# Altium schematic sheet cpuPowerAndJtag.SchDoc
size A
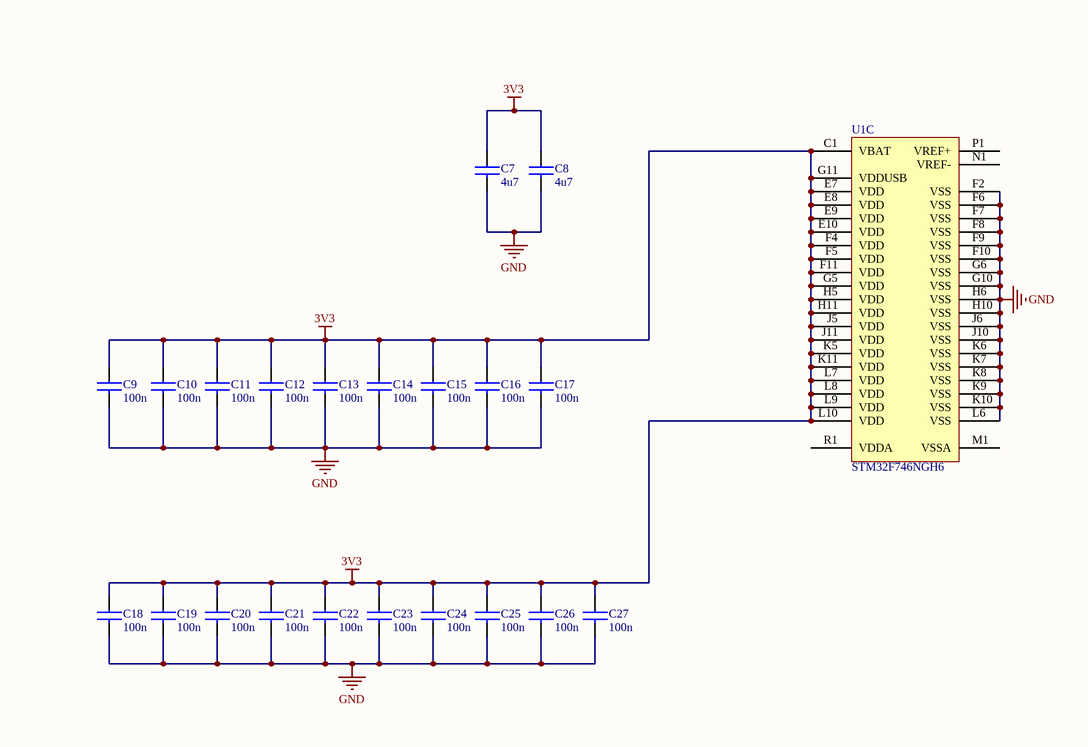
[diagram p0: cpuPowerAndJtag.SchDoc, bottom right]

## Parts
C7  4u7  [C0402]
C8  4u7  [C0402]
C9  100n  [C0402]
C10  100n  [C0402]
C11  100n  [C0402]
C12  100n  [C0402]
C13  100n  [C0402]
C14  100n  [C0402]
C15  100n  [C0402]
C16  100n  [C0402]
C17  100n  [C0402]
C18  100n  [C0402]
C19  100n  [C0402]
C20  100n  [C0402]
C21  100n  [C0402]
C22  100n  [C0402]
C23  100n  [C0402]
C24  100n  [C0402]
C25  100n  [C0402]
C26  100n  [C0402]
C27  100n  [C0402]
U1  STM32F746NGH6  [STM-TFBGA216]  (part C of 3)

## Nets
3V3: C7.1 C8.1 C9.1 C10.1 C11.1 C12.1 C13.1 C14.1 C15.1 C16.1 C17.1 C18.1 C19.1 C20.1 C21.1 C22.1 C23.1 C24.1 C25.1 C26.1 C27.1 U1.C1(VBAT) U1.E7(VDD) U1.E8(VDD) U1.E9(VDD) U1.E10(VDD) U1.F4(VDD) U1.F5(VDD) U1.F11(VDD) U1.G5(VDD) U1.G11(VDDUSB) U1.H5(VDD) U1.H11(VDD) U1.J5(VDD) U1.J11(VDD) U1.K5(VDD) U1.K11(VDD) U1.L7(VDD) U1.L8(VDD) U1.L9(VDD) U1.L10(VDD)
GND: C7.2 C8.2 C9.2 C10.2 C11.2 C12.2 C13.2 C14.2 C15.2 C16.2 C17.2 C18.2 C19.2 C20.2 C21.2 C22.2 C23.2 C24.2 C25.2 C26.2 C27.2 U1.F2(VSS) U1.F6(VSS) U1.F7(VSS) U1.F8(VSS) U1.F9(VSS) U1.F10(VSS) U1.G6(VSS) U1.G10(VSS) U1.H6(VSS) U1.H10(VSS) U1.J6(VSS) U1.J10(VSS) U1.K6(VSS) U1.K7(VSS) U1.K8(VSS) U1.K9(VSS) U1.K10(VSS) U1.L6(VSS)

Not connected (* = marked no-connect by the designer): U1 M1(VSSA) N1(VREF-) P1(VREF+) R1(VDDA)

## Library data of the parts
C7 C8 = C1005X5R1A475M: CAP CER 4.7UF 10V 20% X5R 0402; Manufacturer: TDK Corporation; Capacitance: 4.7µF; .Checked PCB: RF; Supplier 1: Digi-Key; Supplier Part Number 1: 445-8023-1-ND; Manufacturer Part Number: C1005X5R1A475M; RoHS: RoHS Compliant; Category: Capacitors; Stock 1: 10140; Pricing 1: 1=0.53, 10=0.415, 100=0.25, 250=0.18752, 500=0.16, 1000=0.125, 5000=0.095 (USD); Voltage - Rated: 10V; Tolerance: ±20%; Temperature Coefficient: X5R; Mounting Type: Surface Mount, MLCC; Operating Temperature: -55°C ~ 85°C; Applications: General Purpose; Ratings: -; Package / Case: 0402 (1005 Metric); Size / Dimension: 0.039" L x 0.020" W (1.00mm x 0.50mm); Height - Seated (Max): -; Thickness (Max): -; Lead Spacing: -; Features: -; Packaging: Cut Tape (CT); Lead Style: -; ComponentLink1URL: http://www.tdk.com/pdf/general_B11.pdf; ComponentLink1Description: http://www.tdk.com/pdf/general_B11.pdf; .Checked SCH: RF
C9-C27 = C1005X5R1H104K: CAP CER .10UF 50V X5R 10% 0402; Manufacturer: TDK Corporation; Capacitance: 0.1µF; Value: 100nF; .Checked PCB: used; Category: Capacitors; Supplier Part Number: 445-5942-1-ND; Manufacturer Part Number: C1005X5R1H104K; Operating Temperature: -55°C ~ 85°C; Package / Case: 0402 (1005 Metric); Price 1k [$]: 0.02340; .Checked SCH: used; Voltage - Rated: 50V; Supplier: Digikey; Supplier 1: Digi-Key; Supplier Part Number 1: 445-5942-1-ND; RoHS: RoHS Compliant; Stock 1: 106926; Pricing 1: 1=0.27, 10=0.18, 100=0.072, 250=0.05176, 500=0.0369, 1000=0.027 (USD); Tolerance: ±10%; Temperature Coefficient: X5R; Mounting Type: Surface Mount, MLCC; Applications: General Purpose; Ratings: -; Size / Dimension: 0.039" L x 0.020" W (1.00mm x 0.50mm); Height - Seated (Max): -; Thickness (Max): 0.022" (0.55mm); Lead Spacing: -; Features: -; Packaging: Cut Tape (CT); Lead Style: -; ComponentLink1URL: http://www.tdk.co.jp/tefe02/e412_c.pdf; ComponentLink1Description: http://www.tdk.co.jp/tefe02/e412_c.pdf
U1 = STM32F746NGH6: ARM-Based Cortex-M7 32 Bit MCU+FPU, 462 DMIPS, 1024 kB Flash, 320 kB RAM, 168 I/Os, -40 to 85 degC, 216-Pin TFBGA, Halogen-Free, Tray; L1 Cache Data Memory: 4 KByte; Program Memory Size: 1024 KByte; Supply Voltage Max: 3.6 V; Clock Frequency Max: 216 MHz; Supply Voltage Min: 1.7 V; Number of I/Os: 168; Data RAM Size: 320 KByte; Data Bus Width: 32 bit; Temperature Min: -40 degC; L1 Cache Instruction Memory: 4 KByte; PartNumber: STM32F746NG; ComponentLink1Description: Manufacturer URL; ComponentLink2Description: Datasheet; DatasheetVersion: Rev. 1; ComponentLink3URL: http://www.st.com/st-web-ui/static/active/en/resource/technical/document/data_brief/DM00053488.pdf; ComponentLink1URL: http://www.st.com/web/en/home.html; Packing: Tray; ComponentLink2URL: http://www.st.com/st-web-ui/static/active/en/resource/technical/document/datasheet/DM00166116.pdf; ComponentLink3Description: Package Specification; PackageVersion: Rev. 2, 05/2013; Mounting Technology: Surface Mount; PackageDescription: 216-Ball Ultra Thin Fine Pitch Ball Grid Array, 13 x 13 x 0.8 mm Body, 0.8 mm Pitch; Temperature Max: 85 degC